# Altium schematic sheet Sheet1.SchDoc
size A4; SheetNumber: 1; SheetTotal: 1
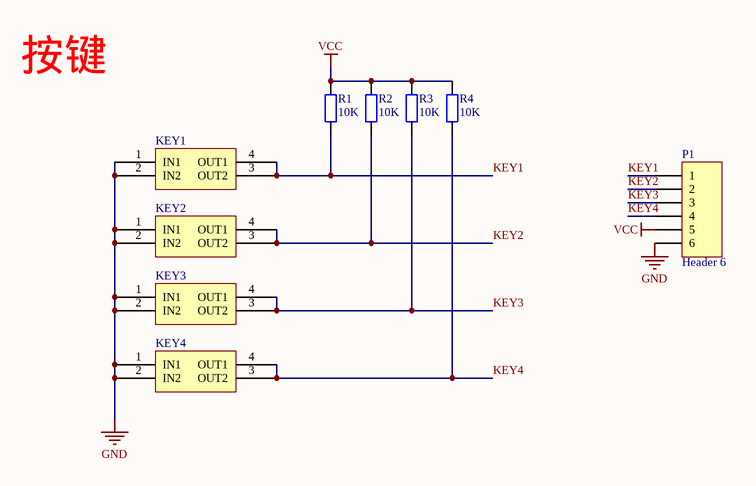
[diagram p0: Sheet1.SchDoc]

## Parts
KEY1  KEY  [KEY]  (value not drawn)
KEY2  KEY  [KEY]  (value not drawn)
KEY3  KEY  [KEY]  (value not drawn)
KEY4  KEY  [KEY]  (value not drawn)
P1  Header 6  [HDR1X6]
R1  10K  [R 0603_M]
R2  10K  [R 0603_M]
R3  10K  [R 0603_M]
R4  10K  [R 0603_M]

## Nets
GND: KEY1.1(IN1) KEY1.2(IN2) KEY2.1(IN1) KEY2.2(IN2) KEY3.1(IN1) KEY3.2(IN2) KEY4.1(IN1) KEY4.2(IN2) P1.6
VCC: P1.5 R1.2 R2.2 R3.2 R4.2
KEY1: KEY1.3(OUT2) KEY1.4(OUT1) P1.1 R1.1
KEY2: KEY2.3(OUT2) KEY2.4(OUT1) P1.2 R2.1
KEY3: KEY3.3(OUT2) KEY3.4(OUT1) P1.3 R3.1
KEY4: KEY4.3(OUT2) KEY4.4(OUT1) P1.4 R4.1

## Notes on the sheet
- 按键

## Library data of the parts
P1 = Header 6: Header, 6-Pin; LatestRevisionDate: 17-Jul-2002; LatestRevisionNote: Re-released for DXP Platform.; Publisher: Altium Limited
R1-R4 = R: 贴片电阻; 淘宝ID: 小糖豆的小窝窝; BOM名称: 贴片电阻; 下单链接: https://item.taobao.com/item.htm?ft=t&id=613637044352